# EAGLE schematic Actuator (EAGLE 9.6.2)

## Sheet 1 of 2: Part Schematics
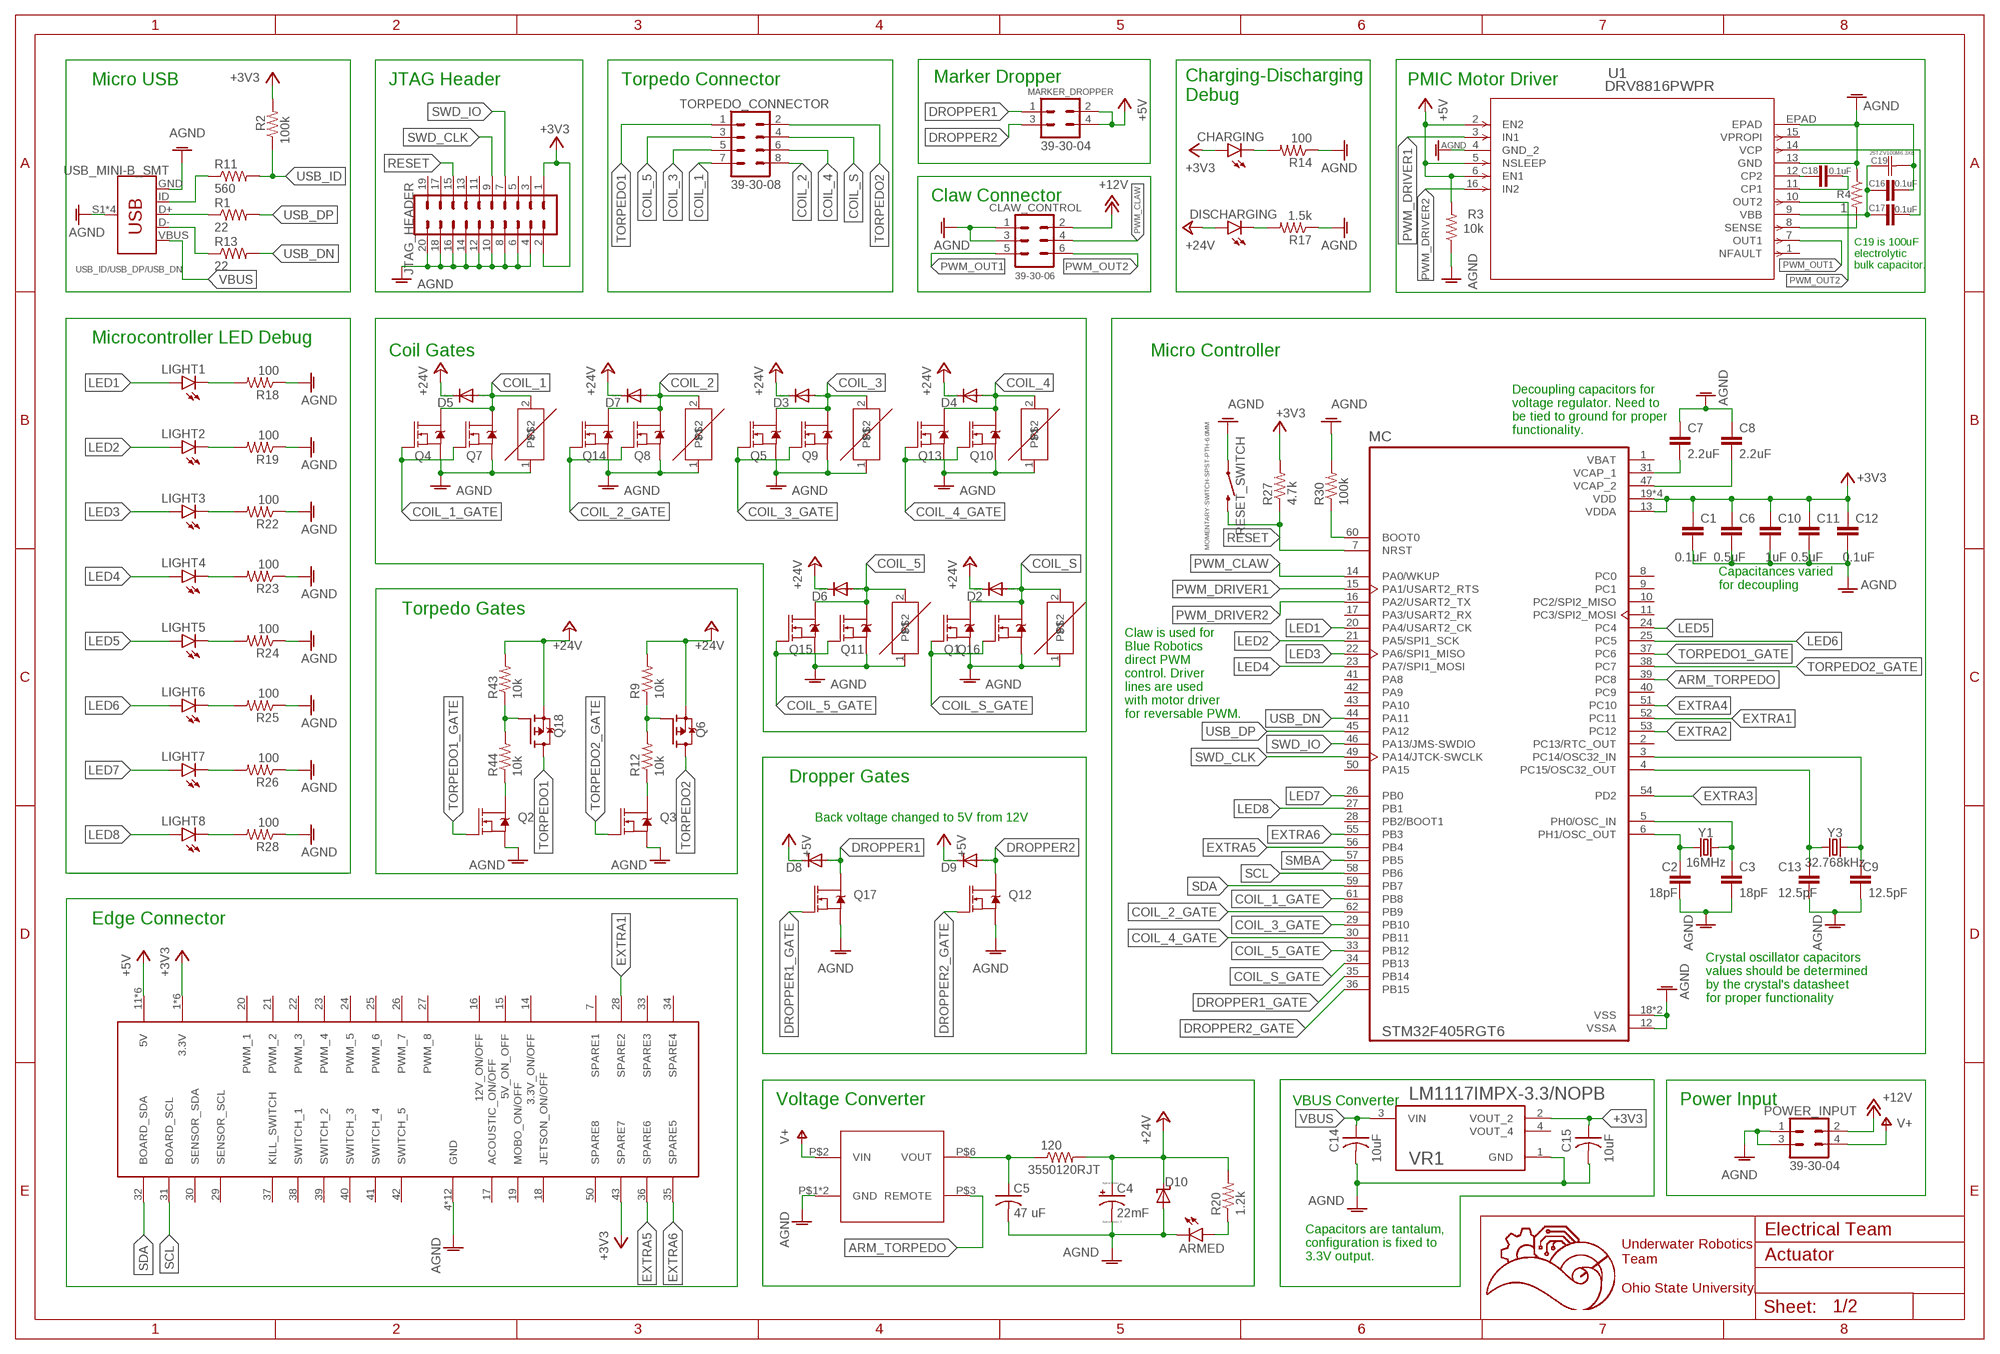
[diagram p0: schematic, sheet 1]

### Parts
120  3550120RJT  [3550120RJT]
ARMED  LEDCHIPLED_0603  [CHIPLED_0603]
C1  0.1uF  C-EUC0603  [C0603]
C2  18pF  C-EUC0603  [C0603]
C3  18pF  C-EUC0603  [C0603]
C4  22mF  CPOL-USE10-30  [EB30D]
C5  47 uF  C-USC1206K  [C1206K]
C6  0.5uF  C-EUC0603  [C0603]
C7  2.2uF  C-EUC0603  [C0603]
C8  2.2uF  C-EUC0603  [C0603]
C9  12.5pF  C-EUC0603  [C0603]
C10  1uF  C-EUC0603  [C0603]
C11  0.5uF  C-EUC0603  [C0603]
C12  0.1uF  C-EUC0603  [C0603]
C13  12.5pF  C-EUC0603  [C0603]
C14  10uF  C-USC0603  [C0603]
C15  10uF  C-USC0603  [C0603]
C16  0.1uF  C-EUC0603  [C0603]
C17  0.1uF  C-EUC0603  [C0603]
C18  0.1uF  C-EUC0603  [C0603]
C19  25TZV100M6.3X8  [CAP_J-V_6P3X8_RUB]
CHARGING  LEDCHIPLED_0603  [CHIPLED_0603]
CLAW_CONTROL  39-30-06  [39-30-?06?]
D2  DIODE-SMB  [SMB]
D3  DIODE-SMB  [SMB]
D4  DIODE-SMB  [SMB]
D5  DIODE-SMB  [SMB]
D6  DIODE-SMB  [SMB]
D7  DIODE-SMB  [SMB]
D8  DIODE-SMB  [SMB]
D9  DIODE-SMB  [SMB]
D10  SUPPRESSOR-SMBJ  [SMBJ]
DISCHARGING  LEDCHIPLED_0603  [CHIPLED_0603]
JTAG_HEADER  CONN_10X2  [2X10]
LIGHT1  LEDCHIPLED_0603  [CHIPLED_0603]
LIGHT2  LEDCHIPLED_0603  [CHIPLED_0603]
LIGHT3  LEDCHIPLED_0603  [CHIPLED_0603]
LIGHT4  LEDCHIPLED_0603  [CHIPLED_0603]
LIGHT5  LEDCHIPLED_0603  [CHIPLED_0603]
LIGHT6  LEDCHIPLED_0603  [CHIPLED_0603]
LIGHT7  LEDCHIPLED_0603  [CHIPLED_0603]
LIGHT8  LEDCHIPLED_0603  [CHIPLED_0603]
MARKER_DROPPER  39-30-04  [39-30-?04?]
MC  STM32F405RGT6  [QFP50P1200X1200X160-64N]
POWER_INPUT  39-30-04  [39-30-?04?]
Q1  MOSFET-NCH-AO3404A  [SOT23-3]
Q2  MOSFET-NCH-AO3404A  [SOT23-3]
Q3  MOSFET-NCH-AO3404A  [SOT23-3]
Q4  MOSFET-NCH-AO3404A  [SOT23-3]
Q5  MOSFET-NCH-AO3404A  [SOT23-3]
Q6  FDD4141TO252  [TO252]
Q7  MOSFET-NCH-AO3404A  [SOT23-3]
Q8  MOSFET-NCH-AO3404A  [SOT23-3]
Q9  MOSFET-NCH-AO3404A  [SOT23-3]
Q10  MOSFET-NCH-AO3404A  [SOT23-3]
Q11  MOSFET-NCH-AO3404A  [SOT23-3]
Q12  MOSFET-NCH-AO3404A  [SOT23-3]
Q13  MOSFET-NCH-AO3404A  [SOT23-3]
Q14  MOSFET-NCH-AO3404A  [SOT23-3]
Q15  MOSFET-NCH-AO3404A  [SOT23-3]
Q16  MOSFET-NCH-AO3404A  [SOT23-3]
Q17  MOSFET-NCH-AO3404A  [SOT23-3]
Q18  FDD4141TO252  [TO252]
R1  22  R-US_R0603  [R0603]
R2  100k  R-US_R0603  [R0603]
R3  10k  R-US_R0603  [R0603]
R4  1  R-US_R0805  [R0805]
R9  10k  R-US_R0603  [R0603]
R11  560  R-US_R0603  [R0603]
R12  10k  R-US_R0603  [R0603]
R13  22  R-US_R0603  [R0603]
R14  100  R-US_R0805  [R0805]
R17  1.5k  R-US_R0805  [R0805]
R18  100  R-US_R0805  [R0805]
R19  100  R-US_R0805  [R0805]
R20  1.2k  R-US_R0805  [R0805]
R22  100  R-US_R0805  [R0805]
R23  100  R-US_R0805  [R0805]
R24  100  R-US_R0805  [R0805]
R25  100  R-US_R0805  [R0805]
R26  100  R-US_R0805  [R0805]
R27  4.7k  R-US_R0603  [R0603]
R28  100  R-US_R0805  [R0805]
R30  100k  R-US_R0603  [R0603]
R43  10k  R-US_R0603  [R0603]
R44  10k  R-US_R0603  [R0603]
RESET_SWITCH  MOMENTARY-SWITCH-SPST-PTH-6.0MM  [TACTILE_SWITCH_PTH_6.0MM]
TORPEDO_CONNECTOR  39-30-08  [39-30-?08?]
U1  DRV8816PWPR  [PWP_16]
U$1  5530843-EDGE  [5530843-6-BOARDFINGERS]
U$2  ERZ-VF2M270ERZ-VF2M270  [RESM8060X320N]
U$3  ERZ-VF2M270ERZ-VF2M270  [RESM8060X320N]
U$4  ERZ-VF2M270ERZ-VF2M270  [RESM8060X320N]
U$5  ERZ-VF2M270ERZ-VF2M270  [RESM8060X320N]
U$6  TMR6-2415  [TMR6-2415]
U$7  ERZ-VF2M270ERZ-VF2M270  [RESM8060X320N]
U$8  ERZ-VF2M270ERZ-VF2M270  [RESM8060X320N]
USB_ID/USB_DP/USB_DN  USB_MINI-B_SMT  [USB-MINIB]
VR1  LM1117IMPX-3.3/NOPB  [VREG_LM1117IMPX-3.3/NOPB]
Y1  16MHz  CRYSTAL-16MHZPTH-HC49US  [HC49US]
Y3  32.768kHz  CRYSTAL-32.768KHZSMD-3.2X1.5  [CRYSTAL-SMD-3.2X1.5MM]

### Nets
+3V3: C1.1 C6.1 C10.1 C11.1 C12.1 C15.1 CHARGING.A JTAG_HEADER.1 JTAG_HEADER.2 MC.13(VDDA) MC.19(VDD) MC.32(VDD) MC.48(VDD) MC.64(VDD) R2.2 R27.2 U$1.1(3.3V) U$1.2(3.3V) U$1.3(3.3V) U$1.43(SPARE7) U$1.54(3.3V) U$1.55(3.3V) U$1.56(3.3V) VR1.2(VOUT_2)
+5V: D8.C D9.C MARKER_DROPPER.2 MARKER_DROPPER.4 R3.2 U1.2(EN2) U1.5(NSLEEP) U1.6(EN1) U$1.11(5V) U$1.12(5V) U$1.13(5V) U$1.44(5V) U$1.45(5V) U$1.46(5V)
+12V: CLAW_CONTROL.2 POWER_INPUT.2
+24V: 120.P$2 C4.+ D2.C D3.C D4.C D5.C D6.C D7.C D10.C DISCHARGING.A Q6.2(S) Q18.2(S) R9.2 R20.2 R43.2
AGND: ARMED.C C1.2 C2.2 C3.2 C4.- C5.2 C6.2 C7.1 C8.1 C9.2 C10.2 C11.2 C12.2 C13.2 C14.2 C15.2 C16.2 C19.2 CLAW_CONTROL.1 CLAW_CONTROL.3 D10.A JTAG_HEADER.4 JTAG_HEADER.6 JTAG_HEADER.8 JTAG_HEADER.10 JTAG_HEADER.12 JTAG_HEADER.14 JTAG_HEADER.16 JTAG_HEADER.18 JTAG_HEADER.20 MC.12(VSSA) MC.18(VSS) MC.63(VSS) POWER_INPUT.1 POWER_INPUT.3 Q1.2(S) Q2.2(S) Q3.2(S) Q4.2(S) Q5.2(S) Q7.2(S) Q8.2(S) Q9.2(S) Q10.2(S) Q11.2(S) Q12.2(S) Q13.2(S) Q14.2(S) Q15.2(S) Q16.2(S) Q17.2(S) R3.1 R4.1 R14.1 R17.1 R18.1 R19.1 R22.1 R23.1 R24.1 R25.1 R26.1 R28.1 R30.2 RESET_SWITCH.1 U1.4(GND_2) U1.13(GND) U1.EPAD U$1.4(GND) U$1.5(GND) U$1.6(GND) U$1.8(GND) U$1.9(GND) U$1.10(GND) U$1.47(GND) U$1.48(GND) U$1.49(GND) U$1.51(GND) U$1.52(GND) U$1.53(GND) U$2.1 U$3.1 U$4.1 U$5.1 U$6.P$1(GND) U$6.P$7(GND) U$7.1 U$8.1 USB_ID/USB_DP/USB_DN.GND USB_ID/USB_DP/USB_DN.S1(SHIELD) USB_ID/USB_DP/USB_DN.S2(SHIELD) USB_ID/USB_DP/USB_DN.S3(SHIELD) USB_ID/USB_DP/USB_DN.S4(SHIELD) VR1.1(GND)
ARM_TORPEDO: MC.39(PC8) U$6.P$3(REMOTE)
COIL_1: D5.A Q4.3(D) Q7.3(D) TORPEDO_CONNECTOR.7 U$8.2
COIL_1_GATE: MC.61(PB8) Q4.1(G) Q7.1(G)
COIL_2: D7.A Q8.3(D) Q14.3(D) TORPEDO_CONNECTOR.8 U$7.2
COIL_2_GATE: MC.62(PB9) Q8.1(G) Q14.1(G)
COIL_3: D3.A Q5.3(D) Q9.3(D) TORPEDO_CONNECTOR.5 U$5.2
COIL_3_GATE: MC.29(PB10) Q5.1(G) Q9.1(G)
COIL_4: D4.A Q10.3(D) Q13.3(D) TORPEDO_CONNECTOR.6 U$4.2
COIL_4_GATE: MC.30(PB11) Q10.1(G) Q13.1(G)
COIL_5: D6.A Q11.3(D) Q15.3(D) TORPEDO_CONNECTOR.3 U$3.2
COIL_5_GATE: MC.33(PB12) Q11.1(G) Q15.1(G)
COIL_S: D2.A Q1.3(D) Q16.3(D) TORPEDO_CONNECTOR.4 U$2.2
COIL_S_GATE: MC.34(PB13) Q1.1(G) Q16.1(G)
DROPPER1: D8.A MARKER_DROPPER.1 Q17.3(D)
DROPPER1_GATE: MC.35(PB14) Q17.1(G)
DROPPER2: D9.A MARKER_DROPPER.3 Q12.3(D)
DROPPER2_GATE: MC.36(PB15) Q12.1(G)
EXTRA1: MC.52(PC11) U$1.28(SPARE2)
EXTRA2: MC.53(PC12)
EXTRA3: MC.54(PD2)
EXTRA4: MC.51(PC10)
EXTRA5: MC.56(PB4) U$1.36(SPARE6)
EXTRA6: MC.55(PB3) U$1.35(SPARE5)
LED1: LIGHT1.A MC.20(PA4/USART2_CK)
LED2: LIGHT2.A MC.21(PA5/SPI1_SCK)
LED3: LIGHT3.A MC.22(PA6/SPI1_MISO)
LED4: LIGHT4.A MC.23(PA7/SPI1_MOSI)
LED5: LIGHT5.A MC.24(PC4)
LED6: LIGHT6.A MC.25(PC5)
LED7: LIGHT7.A MC.26(PB0)
LED8: LIGHT8.A MC.27(PB1)
N$2: C2.1 MC.6(PH1/OSC_OUT) Y1.1
N$3: C3.1 MC.5(PH0/OSC_IN) Y1.2
N$4: CHARGING.C R14.2
N$5: C8.2 MC.47(VCAP_2)
N$6: R11.1 USB_ID/USB_DP/USB_DN.ID
N$7: R1.1 USB_ID/USB_DP/USB_DN.D+
N$8: R13.1 USB_ID/USB_DP/USB_DN.D-
N$10: ARMED.A R20.1
N$11: C7.2 MC.31(VCAP_1)
N$12: C13.1 MC.4(PC15/OSC32_OUT) Y3.P$2
N$15: DISCHARGING.C R17.2
N$16: LIGHT1.C R18.2
N$17: LIGHT2.C R19.2
N$18: LIGHT3.C R22.2
N$19: LIGHT4.C R23.2
N$21: LIGHT5.C R24.2
N$22: LIGHT6.C R25.2
N$23: LIGHT7.C R26.2
N$24: LIGHT8.C R28.2
N$26: 120.P$1 C5.1 U$6.P$6(VOUT)
N$29: C9.1 MC.3(PC14/OSC32_IN) Y3.P$1
N$30: MC.60(BOOT0) R30.1
N$33: Q18.1(G) R43.1 R44.2
N$34: Q2.3(D) R44.1
N$35: Q6.1(G) R9.1 R12.2
N$36: Q3.3(D) R12.1
N$45: R4.2 U1.8(SENSE)
N$46: C17.2 U1.14(VCP)
N$47: C16.1 C17.1 C19.1 U1.9(VBB)
N$48: C18.2 U1.11(CP1)
N$49: C18.1 U1.12(CP2)
PWM_CLAW: CLAW_CONTROL.4 MC.14(PA0/WKUP)
PWM_DRIVER1: MC.15(PA1/USART2_RTS) U1.3(IN1)
PWM_DRIVER2: MC.16(PA2/USART2_TX) U1.16(IN2)
PWM_OUT1: CLAW_CONTROL.5 U1.7(OUT1)
PWM_OUT2: CLAW_CONTROL.6 U1.10(OUT2)
RESET: JTAG_HEADER.15 MC.7(NRST) R27.1 RESET_SWITCH.3
SCL: MC.58(PB6) U$1.31(BOARD_SCL)
SDA: MC.59(PB7) U$1.32(BOARD_SDA)
SMBA: MC.57(PB5)
SWD_CLK: JTAG_HEADER.9 MC.49(PA14/JTCK-SWCLK)
SWD_IO: JTAG_HEADER.7 MC.46(PA13/JMS-SWDIO)
TORPEDO1: Q18.3(D) TORPEDO_CONNECTOR.1
TORPEDO1_GATE: MC.37(PC6) Q2.1(G)
TORPEDO2: Q6.3(D) TORPEDO_CONNECTOR.2
TORPEDO2_GATE: MC.38(PC7) Q3.1(G)
USB_DN: MC.44(PA11) R13.2
USB_DP: MC.45(PA12) R1.2
USB_ID: R2.1 R11.2
V+: POWER_INPUT.4 U$6.P$2(VIN)
VBUS: C14.1 USB_ID/USB_DP/USB_DN.VBUS VR1.3(VIN)
Unconnected: JTAG_HEADER.3 JTAG_HEADER.5 JTAG_HEADER.11 JTAG_HEADER.13 JTAG_HEADER.17 JTAG_HEADER.19 MC.2(PC13/RTC_OUT) MC.8(PC0) MC.9(PC1) MC.10(PC2/SPI2_MISO) MC.11(PC3/SPI2_MOSI) MC.17(PA3/USART2_RX) MC.28(PB2/BOOT1) MC.40(PC9) MC.41(PA8) MC.42(PA9) MC.43(PA10) MC.50(PA15) U1.1(NFAULT) U1.15(VPROPI) U$1.7(SPARE1) U$1.14(3.3V_ON/OFF) U$1.15(5V_ON_OFF) U$1.16(12V_ON/OFF) U$1.17(ACOUSTIC_ON/OFF) U$1.18(JETSON_ON/OFF) U$1.19(MOBO_ON/OFF) U$1.20(PWM_1) U$1.21(PWM_2) U$1.22(PWM_3) U$1.23(PWM_4) U$1.24(PWM_5) U$1.25(PWM_6) U$1.26(PWM_7) U$1.27(PWM_8) U$1.29(SENSOR_SCL) U$1.30(SENSOR_SDA) U$1.33(SPARE3) U$1.34(SPARE4) U$1.37(KILL_SWITCH) U$1.38(SWITCH_1) U$1.39(SWITCH_2) U$1.40(SWITCH_3) U$1.41(SWITCH_4) U$1.42(SWITCH_5) U$1.50(SPARE8) VR1.4(VOUT_4)

### Notes on the sheet
- Micro USB | JTAG Header | Torpedo Connector | Marker Dropper | PMIC Motor Driver
- Charging-Discharging 
  Debug
- Claw Connector
- C19 is 100uF
  electrolytic
  bulk capacitor.
- Microcontroller LED Debug
- Coil Gates | Micro Controller
- Decoupling capacitors for 
  voltage regulator. Need to
  be tied to ground for proper
  functionality.
- Capacitances varied 
  for decoupling
- Torpedo Gates
- Claw is used for
  Blue Robotics
  direct PWM
  control. Driver
  lines are used
  with motor driver
  for reversable PWM.
- Dropper Gates
- Back voltage changed to 5V from 12V
- Edge Connector
- Crystal oscillator capacitors
  values should be determined
  by the crystal's datasheet
  for proper functionality
- Voltage Converter | VBUS Converter | Power Input
- Electrical Team
- Capacitors are tantalum, 
  configuration is fixed to 
  3.3V output.
- Underwater Robotics
  Team
  
  Ohio State University

## Sheet 2 of 2: Notes
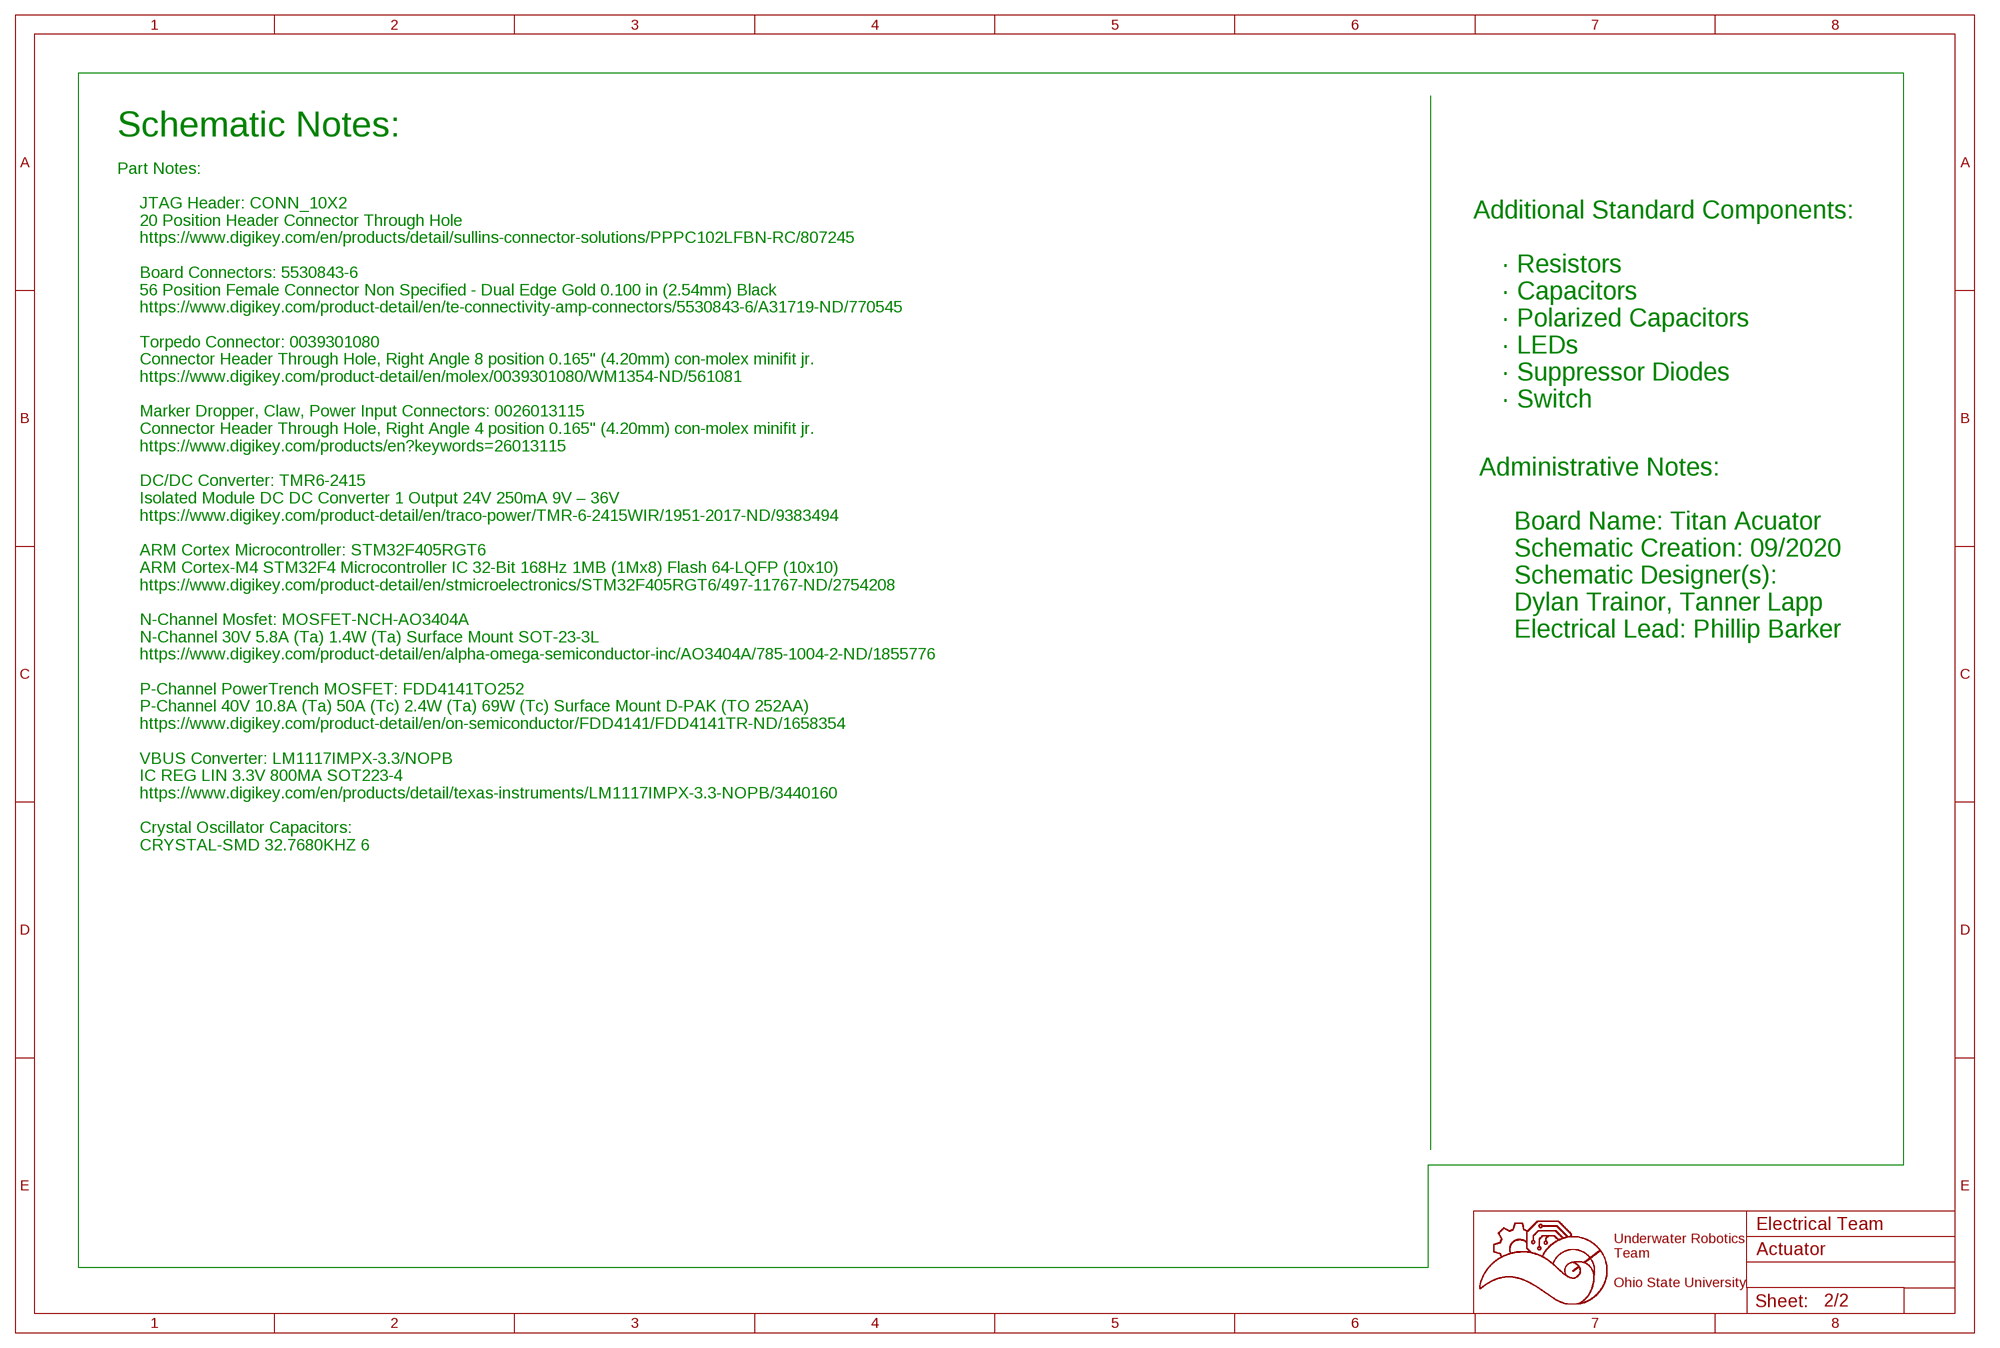
[diagram p1: schematic, sheet 2]

### Notes on the sheet
- Schematic Notes:
- Part Notes:
  
       JTAG Header: CONN_10X2
       20 Position Header Connector Through Hole 
       https://www.digikey.com/en/products/detail/sullins-connector-solutions/PPPC102LFBN-RC/807245
    
       Board Connectors: 5530843-6 
       56 Position Female Connector Non Specified - Dual Edge Gold 0.100 in (2.54mm) Black 
       https://www.digikey.com/product-detail/en/te-connectivity-amp-connectors/5530843-6/A31719-ND/770545 
    
       Torpedo Connector: 0039301080 
       Connector Header Through Hole, Right Angle 8 position 0.165" (4.20mm) con-molex minifit jr. 
       https://www.digikey.com/product-detail/en/molex/0039301080/WM1354-ND/561081 
    
       Marker Dropper, Claw, Power Input Connectors: 0026013115 
       Connector Header Through Hole, Right Angle 4 position 0.165" (4.20mm) con-molex minifit jr. 
       https://www.digikey.com/products/en?keywords=26013115 
    
       DC/DC Converter: TMR6-2415 
       Isolated Module DC DC Converter 1 Output 24V 250mA 9V – 36V 
       https://www.digikey.com/product-detail/en/traco-power/TMR-6-2415WIR/1951-2017-ND/9383494 
    
       ARM Cortex Microcontroller: STM32F405RGT6 
       ARM Cortex-M4 STM32F4 Microcontroller IC 32-Bit 168Hz 1MB (1Mx8) Flash 64-LQFP (10x10) 
       https://www.digikey.com/product-detail/en/stmicroelectronics/STM32F405RGT6/497-11767-ND/2754208 
    
       N-Channel Mosfet: MOSFET-NCH-AO3404A 
       N-Channel 30V 5.8A (Ta) 1.4W (Ta) Surface Mount SOT-23-3L 
       https://www.digikey.com/product-detail/en/alpha-omega-semiconductor-inc/AO3404A/785-1004-2-ND/1855776 
    
       P-Channel PowerTrench MOSFET: FDD4141TO252 
       P-Channel 40V 10.8A (Ta) 50A (Tc) 2.4W (Ta) 69W (Tc) Surface Mount D-PAK (TO 252AA) 
       https://www.digikey.com/product-detail/en/on-semiconductor/FDD4141/FDD4141TR-ND/1658354
  
       VBUS Converter: LM1117IMPX-3.3/NOPB
       IC REG LIN 3.3V 800MA SOT223-4
       https://www.digikey.com/en/products/detail/texas-instruments/LM1117IMPX-3.3-NOPB/3440160
    
       Crystal Oscillator Capacitors: 
       CRYSTAL-SMD 32.7680KHZ 6PF  3.2X1.5MM 
       https://www.digikey.com/en/products/detail/micro-crystal-ag/CM7V-T1A-32-768KHZ-6PF-20PPM-TA-QC/10499118
       CRYSTAL-16MHZPTH-HC49US (CRYSTAL-16MHZ)
       https://www.digikey.com/en/products/detail/abracon-llc/ABM3B-16-000MHZ-B2-T/675317?s=N4IgTCBcDaIKwGY4FoCcBGMZnuQOQBEQBdAXyA 
  
       ERZ-VF2M270 Varistor
       VARISTOR 27V 125A 2SMD JLEAD
       https://www.digikey.com/en/products/detail/panasonic-electronic-components/ERZ-VF2M270/672899
  
       3550120RJT Resistor
       RES 3550 120 Ohm 5% 5W
       https://www.digikey.com/en/products/detail/te-connectivity-passive-product/3550120RJT/9927251
  
       DRV8816PWPR Motor Driver
       IC MOTOR DRIVER 8V-38V 16HTSSOP
       https://www.digikey.com/en/products/detail/texas-instruments/DRV8816PWPR/4439658
  
       25TZV100M6.3X8 Electrolytic Capacitor
       CAP ALUM 100UF 20% 25V SMD
       https://www.digikey.com/en/products/detail/rubycon/25TZV100M6-3X8/3134865
- Additional Standard Components:
  
       · Resistors 
       · Capacitors 
       · Polarized Capacitors 
       · LEDs 
       · Suppressor Diodes 
       · Switch
- Administrative Notes:
  
       Board Name: Titan Acuator
       Schematic Creation: 09/2020
       Schematic Designer(s): 
       Dylan Trainor, Tanner Lapp
       Electrical Lead: Phillip Barker
- Electrical Team
- Underwater Robotics
  Team
  
  Ohio State University

## Power pins joined to a net without a drawn wire
VBAT: MC.1(VBAT)

## Library data of the parts
120 = 3550120RJT:3550120RJT
ARMED CHARGING DISCHARGING LIGHT1-LIGHT8 = led:LED: LED OSRAM: - CHIPLED LG R971, LG N971, LY N971, LG Q971, LY Q971, LO R971, LY R971 LH N974, LH R974 LS Q976, LO Q976, LY Q976 LO Q996 - Hyper CHIPLED LW Q18S LB Q993, LB Q99A, LB R99A - SideLED LS A670, LO A670, LY A670, LG A670, LP A670 LB A673, LV A673, LT A673, LW A673 LH A674 LY A675 LS A676, LA A676, LO A676, LY A676, LW A676 LS A679, LY A679, LG A679 - Hyper Micro SIDELED® LS Y876, LA Y876, LO Y876, LY Y876 LT Y87S - SmartLED LW L88C, LW L88S LB L89C, LB L89S, LG L890 LS L89K, LO L89K, LY L89K LS L896, LA L896, LO L896, LY L896 - TOPLED LS T670, LO T670, LY T670, LG T670, LP T670 LSG T670, LSP T670, LSY T670, LOP T670, LYG T670 LG T671, LOG T671, LSG T671 LB T673, LV T673, LT T673, LW T673 LH T674 LS T676, LA T676, LO T676, LY T676, LB T676, LH T676, LSB T676, LW T676 LB T67C, LV T67C, LT T67C, LS T67K, LO T67K, LY T67K, LW E67C LS E67B, LA E67B, LO E67B, LY E67B, LB E67C, LV E67C, LT E67C LW T67C LS T679, LY T679, LG T679 LS T770, LO T770, LY T770, LG T770, LP T770 LB T773, LV T773, LT T773, LW T773 LH T774 LS E675, LA E675, LY E675, LS T675 LS T776, LA T776, LO T776, LY T776, LB T776 LHGB T686 LT T68C, LB T68C - Hyper Mini TOPLED® LB M676 - Mini TOPLED Santana® LG M470 LS M47K, LO M47K, LY M47K Source: http://www.osram.convergy.de LUXEON: - LUMILED® LXK2-PW12-R00, LXK2-PW12-S00, LXK2-PW14-U00, LXK2-PW14-V00 LXK2-PM12-R00, LXK2-PM12-S00, LXK2-PM14-U00 LXK2-PE12-Q00, LXK2-PE12-R00, LXK2-PE12-S00, LXK2-PE14-T00, LXK2-PE14-U00 LXK2-PB12-K00, LXK2-PB12-L00, LXK2-PB12-M00, LXK2-PB14-N00, LXK2-PB14-P00, LXK2-PB14-Q00 LXK2-PR12-L00, LXK2-PR12-M00, LXK2-PR14-Q00, LXK2-PR14-R00 LXK2-PD12-Q00, LXK2-PD12-R00, LXK2-PD12-S00 LXK2-PH12-R00, LXK2-PH12-S00 LXK2-PL12-P00, LXK2-PL12-Q00, LXK2-PL12-R00 Source: www.luxeon.com KINGBRIGHT: KA-3528ASYC Source: www.kingbright.com
C1-C3 C6-C13 C16-C18 = rcl:C-EU: CAPACITOR, European symbol; SPICEPREFIX: C
C4 = resistor:CPOL-US: POLARIZED CAPACITOR, American symbol
C5 = resistor:C-US: CAPACITOR, American symbol
C14 C15 = rcl:C-US: CAPACITOR, American symbol; SPICEPREFIX: C
C19 = 25TZV100M6_3X8:25TZV100M6.3X8; BUILT_BY: EMA_Cory; COPYRIGHT: Copyright (C) 2018 Accelerated Designs. All rights reserved; MANUFACTURER_PART_NUMBER: 25TZV100M6.3X8; SOURCELIBRARY: Rubycon_2019-09-19; VENDOR: Rubycon Netherlands
CLAW_CONTROL = con-molex-mini-fit:39-30-?06?: HEADER
D2-D9 = diode:DIODE-: DIODE
D10 = diode:SUPPRESSOR-: Suppressor diode
JTAG_HEADER = SparkFun-Connectors:CONN_10X2: Multi connection point. Often used as Generic Header-pin footprint for 0.1 inch spaced/style header connections On any of the 0.1 inch spaced packages, you can populate with these: Break Away Headers - Straight <https://www.sparkfun.com/products/116> (PRT-00116) Break Away Male Headers - Right Angle <https://www.sparkfun.com/products/553> (PRT-00553) Female Headers <https://www.sparkfun.com/products/115> (PRT-00115) Break Away Headers - Machine Pin <https://www.sparkfun.com/products/117> (PRT-00117) Break Away Female Headers - Swiss Machine Pin <https://www.sparkfun.com/products/743> (PRT-00743) Special note about the "SPECIAL" package: This was SPECIALLY designed to be used with our Graphic LCD Backpack. Be sure you want to use this! It is not only staggered on each line of header holes, but IT IS ALSO offset of the center point of the top and bottom lines by 5 mil. This causes the headers to lock into place on the "standard" footprint on the LCD screen. The extra squares on the tdocu layer are there simply to reference other pins (if you were to actually populate a longer header than ten long - this is what we do with the backpacks).
MARKER_DROPPER POWER_INPUT = con-molex-mini-fit:39-30-?04?: HEADER
MC = STM32F405RGT6:STM32F405RGT6: High-performance foundation line, ARM Cortex-M4 core with DSP and FPU, 1 Mbyte Flash, 168 MHz CPU, ART Accelerator; AVAILABILITY: Unavailable; DESCRIPTION: High-performance foundation line, ARM Cortex-M4 core with DSP and FPU, 1 Mbyte Flash, 168 MHz CPU, ART Accelerator; MF: STMicroelectronics; MP: STM32F405RGT6; PACKAGE: LQFP-64 STMicroelectronics; PRICE: None
Q1-Q5 Q7-Q17 = SparkFun-DiscreteSemi:MOSFET-NCH: N-channel MOSFETs Voltage controlled devices that allow control of high current outputs. SparkFun Products: SparkFun OpenScale <https://www.sparkfun.com/products/13261> SparkFun Digital Sandbox <https://www.sparkfun.com/products/12651> SparkFun Monster Moto Shield <https://www.sparkfun.com/products/10182> SparkFun MOSFET Power Controller <https://www.sparkfun.com/products/11214>; PROD_ID: TRANS-12988; VALUE: 5.8A/30V/35mΩ
Q6 Q18 = transistor-fet:FDD4141: P-Channel PowerTrench® MOSFET Source: FDD4141.pdf
R1 R2 R11 R13 R27 R30 = rcl:R-US_: RESISTOR, American symbol; SPICEPREFIX: R
R3 R4 R9 R12 R14 R17-R20 R22-R26 R28 R43 R44 = resistor:R-US_: RESISTOR, American symbol
RESET_SWITCH = SparkFun-Switches:MOMENTARY-SWITCH-SPST: Momentary Switch (Pushbutton) - SPST Normally-open (NO) SPST momentary switches (buttons, pushbuttons). Variants PTH-12MM - 12mm square, through-hole Momentary Pushbutton Switch - 12mm Square <https://www.sparkfun.com/products/9190> (COM-09190) PTH-6.0MM, PTH-6.0MM-KIT - 6.0mm square, through-hole Mini Pushbutton Switch <https://www.sparkfun.com/products/97> (COM-00097) KIT package intended for soldering kit's - only one side of pads' copper is exposed. PTH-RIGHT-ANGLE-KIT - Right-angle, through-hole Right Angle Tactile Button <https://www.sparkfun.com/products/10791> - Used on SparkFun BigTime Watch Kit <https://www.sparkfun.com/products/11734> SMD-12MM - 12mm square, surface-mount Tactile Button - SMD (12mm) <https://www.sparkfun.com/products/12993> (COM-12993) Used on SparkFun PicoBoard <https://www.sparkfun.com/products/11888> SMD-4.5MM - 4.5mm Square Trackball Switch Used on SparkFun Blackberry Trackballer Breakout <https://www.sparkfun.com/products/13169> SMD-4.6MMX2.8MM - 4.60mm x 2.80mm, surface mount Used on SparkFun SAMD21 Mini Breakout <https://www.sparkfun.com/products/13664> SMD-5.2MM, SMD-5.2-REDUNDANT - 5.2mm square, surface-mount Mini Pushbutton Switch - SMD <https://www.sparkfun.com/products/8720> (COM-08720) Used on Arduino Pro Mini <https://www.sparkfun.com/products/11114> REDUNDANT package connects both switch circuits together SMD-6.0X3.5MM - 6.0 x 3.5mm, surface mount Momentary Reset Switch SMD <https://www.sparkfun.com/products/8229> (COM-08229) SMD-6.2MM-TALL - 6.2mm square, surface mount Tactile Button - SMD (6mm) <https://www.sparkfun.com/products/12992> Used on SparkFun Digital Sandbox <https://www.sparkfun.com/products/12651> SMD-RIGHT-ANGLE - Right-angle, surface mount Used on SparkFun Block for Intel® Edison - Arduino <https://www.sparkfun.com/products/13036>; PROD_ID: SWCH-08441; SF_SKU: COM-00097
TORPEDO_CONNECTOR = con-molex-mini-fit:39-30-?08?: HEADER
U1 = DRV8816POWPR:DRV8816PWPR; MANUFACTURER_PART_NUMBER: DRV8816PWPR; VENDOR: Texas Instruments
U$1 = 5530843-6:5530843-EDGE
U$2-U$5 U$7 U$8 = ERZ-VF2M270:ERZ-VF2M270
U$6 = converter:TMR6-2415
USB_ID/USB_DP/USB_DN = SparkFun-Connectors:USB_MINI-B: USB type Mini-B Connector Breaks out 5th pin, and includes shield pins if needed. SparkFun Products: SparkFun FTDI Basic Breakout <https://www.sparkfun.com/products/9716> SparkFun XBee Explorer USB <https://www.sparkfun.com/products/11812> SparkFun Redboard <https://www.sparkfun.com/products/12757>; PROD_ID: CONN-08193; SF_ID: PRT-00587
VR1 = LM1117IMPX-3.3_NOPB:LM1117IMPX-3.3/NOPB: 800-mA 15-V linear voltage regulator 4-SOT-223 0 to 125 Check prices <https://pricing.snapeda.com/parts/LM1117IMPX-3.3/NOPB/Texas%20Instruments/view-part?ref=eda>; AVAILABILITY: Good; DESCRIPTION: 800-mA 15-V linear voltage regulator 4-SOT-223 -40 to 125; MF: Texas Instruments; MP: LM1117IMPX-3.3/NOPB; PACKAGE: SOT-223-4 Texas Instruments; PRICE: None; PURCHASE-URL: https://pricing.snapeda.com/search/part/LM1117IMPX-3.3/NOPB/?ref=eda
Y1 = SparkFun-Clocks:CRYSTAL-16MHZ: 16MHz Crystal Digikey Example <http://www.digikey.com/product-search/en?keywords=535-9122-1-ND> Frequency: 16MHz Frequency Stability: ±50ppm Frequency Tolerance: ±20ppm Load Capacitance: 18pF SparkFun Products: Pro Micro -5V/16MHz <https://www.sparkfun.com/products/12640> SparkFun Serial Enabled LCD Kit <https://www.sparkfun.com/products/10097>; PROD_ID: XTAL-08181; SF_ID: COM-00536
Y3 = SparkFun-Clocks:CRYSTAL-32.768KHZ: 32.768kHz Crystal Frequency: 32.768kHz Frequency Stability: ±20ppm Load Capacitance: 12.5pF (PTH-2X6 & SMD-3.2X1.5), 6pF (SMD-2X6) SparkFun Products: SparkFun BigTime Watch Kit <https://www.sparkfun.com/products/11734> SparkFun nRF52832 Breakout <https://www.sparkfun.com/products/13990> SparkFun Real Time Clock Module <https://www.sparkfun.com/products/12708>; PROD_ID: XTAL-13062